# Altium project 04-ADC_antialiasing.PrjPcb
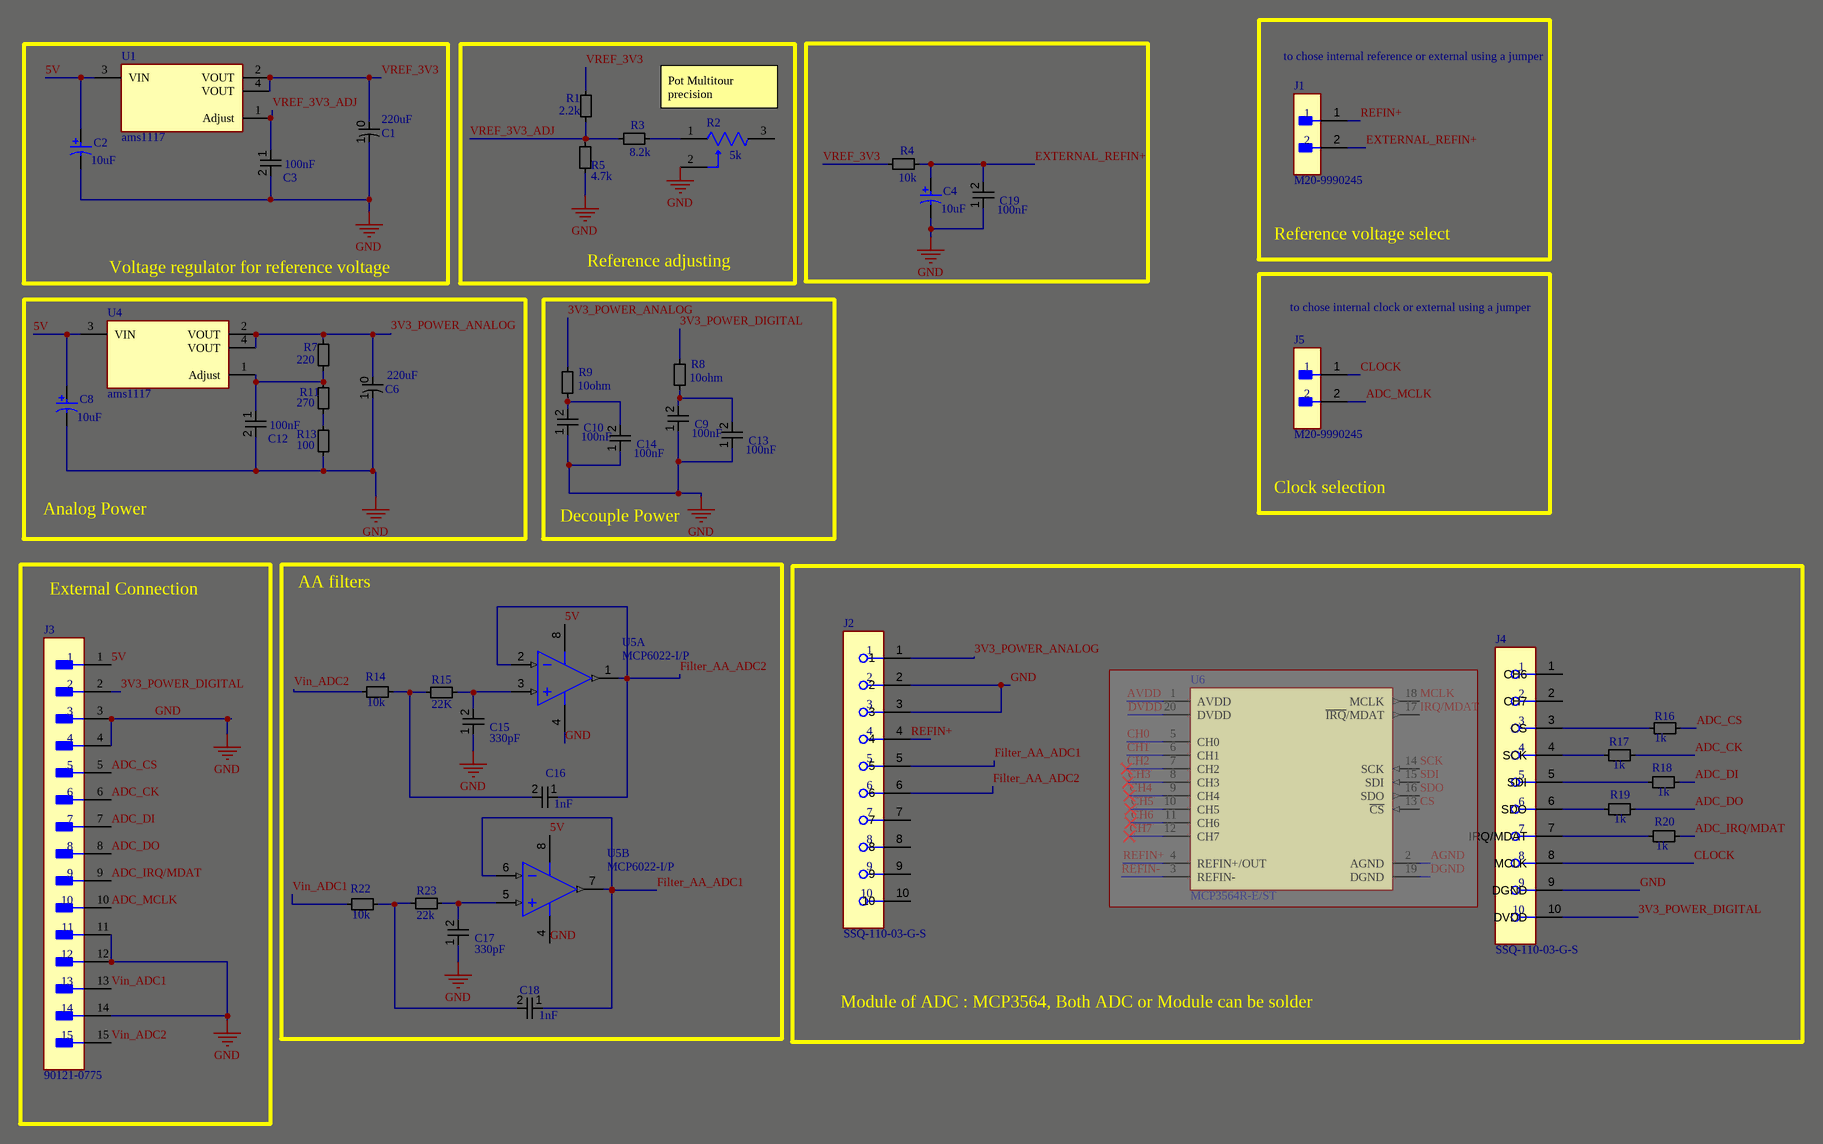
[diagram p0: 04-ADC_antialiasing.SchDoc]
CAGE_CODE: ?????; CONTRACT_NUMBER: <CONTRACT NO>; DOC_NO_ASSY_DWG: <ASSY DWG NO>; DOC_NO_BOM: <BOM DOC NO>; DOC_NO_FAB_DWG: <FAB DWG NO>; DOC_NO_SCH_DWG: <SCH DWG NO>; PCB_2_DEC_TOL: +/-.01; PCB_3_DEC_TOL: +/-.010; PCB_ANG_TOL: +/-1/2; PCB_ASSEMBLY_NO: <PCB ASSY NO>; PCB_CHECKER: - -----; PCB_CHECKER_APP_DATE: --/--/----; PCB_DESIGNER: - -----; PCB_DESIGNER_APP_DATE: --/--/----; PCB_DWG_NO: <PCB DWG NO>; PCB_ENGINEER: - -----; PCB_ENGINEER_APP_DATE: --/--/----; PCB_PART_NUMBER: <PCB PN>; PCB_REV: A; SCH_REV: A
1 sheet, 44 parts. Net scope: global (net labels, ports and power ports of the same name join across sheets).
Board file: 04-ADC_antialiasing.PcbDoc

## Sheet 04-ADC_antialiasing.SchDoc
size 431 x 279 mm; SheetNumber: 1; SheetTotal: 1; ENG_APP_DATE: --/--/--; DSN_APP_DATE: --/--/--; CHK_APP_DATE: --/--/--

### Parts
C1  value 220uF  [Cap_Pol_1cm_5mmPads_15mmmHigh]  (hidden comment: Cap_Pol)
C2  Capacitance: 10uF  [CAPPR55-200-1100X500X1200]  (hidden comment: ECA1HM100)
C3  value 100nF  [Cap_6.0%2A2.5%2A6mm]  (hidden comment: Cap_6.0*2.5*6mm)
C4  Capacitance: 10uF  [CAPPR55-200-1100X500X1200]  (hidden comment: ECA1HM100)
C6  value 220uF  [Cap_Pol_1cm_5mmPads_15mmmHigh]  (hidden comment: Cap_Pol)
C8  Capacitance: 10uF  [CAPPR55-200-1100X500X1200]  (hidden comment: ECA1HM100)
C9  value 100nF  [Cap_6.0%2A2.5%2A6mm]  (hidden comment: Cap_5.0*2.5*6mm)
C10  value 100nF  [Cap_6.0%2A2.5%2A6mm]  (hidden comment: Cap_5.0*2.5*6mm)
C12  value 100nF  [Cap_6.0%2A2.5%2A6mm]  (hidden comment: Cap_6.0*2.5*6mm)
C13  value 100nF  [Cap_6.0%2A2.5%2A6mm]  (hidden comment: Cap_5.0*2.5*6mm)
C14  value 100nF  [Cap_6.0%2A2.5%2A6mm]  (hidden comment: Cap_5.0*2.5*6mm)
C15  value 330pF  [Cap_6.0%2A2.5%2A6mm]  (hidden comment: Cap_6.0*2.5*6mm)
C16  value 1nF  [Cap_6.0%2A2.5%2A6mm]  (hidden comment: Cap_6.0*2.5*6mm)
C17  value 330pF  [Cap_6.0%2A2.5%2A6mm]  (hidden comment: Cap_6.0*2.5*6mm)
C18  value 1nF  [Cap_6.0%2A2.5%2A6mm]  (hidden comment: Cap_6.0*2.5*6mm)
C19  value 100nF  [Cap_6.0%2A2.5%2A6mm]  (hidden comment: Cap_5.0*2.5*6mm)
J1  M20-9990245  [FP-M20-9990245-MFG]
J2  SSQ-110-03-G-S  [FP-SSQ-110-03-G-S-MFG]
J3  90121-0775  [FP-90121-0775-MFG]
J4  SSQ-110-03-G-S  [FP-SSQ-110-03-G-S-MFG]
J5  M20-9990245  [FP-M20-9990245-MFG]
R1  value 2.2k  [Res_Axial_3.5x6.5mm_TH]  (hidden comment: Res_3.5x6.5mm_TH)
R2  Resistance: 5k  [FP-3006P-1-104LF-MFG]  (hidden comment: 3006P-1-104LF)
R3  value 8.2k  [Res_Axial_3.5x6.5mm_TH]  (hidden comment: Res_3.5x6.5mm_TH)
R4  value 10k  [Res_Axial_3.5x6.5mm_TH]  (hidden comment: Res_3.5x6.5mm_TH)
R5  value 4.7k  [Res_Axial_3.5x6.5mm_TH]  (hidden comment: Res_3.5x6.5mm_TH)
R7  value 220  [Res_Axial_3.5x6.5mm_TH]  (hidden comment: Res_3.5x6.5mm_TH)
R8  value 10ohm  [Res_Axial_3.5x6.5mm_TH]  (hidden comment: Res_3.5x6.5mm_TH)
R9  value 10ohm  [Res_Axial_3.5x6.5mm_TH]  (hidden comment: Res_3.5x6.5mm_TH)
R11  value 270  [Res_Axial_3.5x6.5mm_TH]  (hidden comment: Res_3.5x6.5mm_TH)
R13  value 100  [Res_Axial_3.5x6.5mm_TH]  (hidden comment: Res_3.5x6.5mm_TH)
R14  value 10k  [Res_Axial_3.5x6.5mm_TH]  (hidden comment: Res_3.5x6.5mm_TH)
R15  value 22K  [Res_Axial_3.5x6.5mm_TH]  (hidden comment: Res_3.5x6.5mm_TH)
R16  value 1k  [Res_Axial_3.5x6.5mm_TH]  (hidden comment: Res_3.5x6.5mm_TH)
R17  value 1k  [Res_Axial_3.5x6.5mm_TH]  (hidden comment: Res_3.5x6.5mm_TH)
R18  value 1k  [Res_Axial_3.5x6.5mm_TH]  (hidden comment: Res_3.5x6.5mm_TH)
R19  value 1k  [Res_Axial_3.5x6.5mm_TH]  (hidden comment: Res_3.5x6.5mm_TH)
R20  value 1k  [Res_Axial_3.5x6.5mm_TH]  (hidden comment: Res_3.5x6.5mm_TH)
R22  value 10k  [Res_Axial_3.5x6.5mm_TH]  (hidden comment: Res_3.5x6.5mm_TH)
R23  value 22k  [Res_Axial_3.5x6.5mm_TH]  (hidden comment: Res_3.5x6.5mm_TH)
U1  ams1117  [FP-ams1117-IPC_C]
U4  ams1117  [FP-ams1117-IPC_C]
U5  MCP6022-I/P  [PDIP300-P8]  (parts A,B of 2)
U6  MCP3564R-E/ST  [FP-C04-088-MFG]  (masked out: inside a compile mask, not in the netlist)

### Blocks framed on the sheet
Voltage regulator for reference voltage: C1-C3 U1
Reference adjusting: R1-R3 R5
Reference voltage select: J1
Analog Power: C6 C8 C12 R7 R11 R13 U4
Decouple Power: C9 C10 C13 C14 R8 R9
Clock selection: J5
External Connection: J3
AA filters: C15-C18 R14 R15 R22 R23 U5
Module of ADC : MCP3564, Both ADC or Module can be solder: J2 J4 R16-R20 U6

### Nets
GND: C1.1 C2.2 C3.2 C4.2 C6.1 C8.2 C9.1 C10.1 C12.2 C13.1 C14.1 C15.1 C17.1 C19.1 J2.2 J2.3 J3.3 J3.4 J3.11 J3.12 J3.14 J4.9(DGND) R2.2(WIPER) R5.1 R13.1 U5.4(VSS)
3V3_POWER_ANALOG: C6.0 J2.1 R7.0 R9.1 U4.2(VOUT) U4.4(VOUT)
3V3_POWER_DIGITAL: J3.2 J4.10(DVDD) R8.1
5V: C2.1 C8.1 J3.1 U1.3(VIN) U4.3(VIN) U5.8(VDD)
ADC_CK: J3.6 R17.0
ADC_CS: J3.5 R16.0
ADC_DI: J3.7 R18.0
ADC_DO: J3.8 R19.0
ADC_IRQ/MDAT: J3.9 R20.0
ADC_MCLK: J3.10 J5.2
CLOCK: J4.8(MCLK) J5.1
EXTERNAL_REFIN+: C4.1 C19.2 J1.2 R4.0
Filter_AA_ADC1: C18.1 J2.5 U5.6(VINB-) U5.7(VOUTB)
Filter_AA_ADC2: C16.1 J2.6 U5.1(VOUTA) U5.2(VINA-)
REFIN+: J1.1 J2.4
Vin_ADC1: J3.13 R22.0
Vin_ADC2: J3.15 R14.0
VREF_3V3: C1.0 R1.0 R4.1 U1.2(VOUT) U1.4(VOUT)
VREF_3V3_ADJ: C3.1 R1.1 R3.1 R5.0 U1.1(Adjust)
NetC9_2: C9.2 C13.2 R8.0
NetC10_2: C10.2 C14.2 R9.0
NetC12_1: C12.1 R7.1 R11.0 U4.1(Adjust)
NetC15_2: C15.2 R15.1 U5.3(VINA+)
NetC16_2: C16.2 R14.1 R15.0
NetC17_2: C17.2 R23.1 U5.5(VINB+)
NetC18_2: C18.2 R22.1 R23.0
NetJ4_3: J4.3(CS) R16.1
NetJ4_4: J4.4(SCK) R17.1
NetJ4_5: J4.5(SDI) R18.1
NetJ4_6: J4.6(SDO) R19.1
NetJ4_7: J4.7(IRQ/MDAT) R20.1
NetR2_1: R2.1(CCW) R3.0
NetR11_1: R11.1 R13.0

Not connected (* = marked no-connect by the designer): J2 7 8 9 10; J4 1(CH6) 2(CH7); R2 3(CW)

### Notes on the sheet
- Pot Multitour precision
- to chose internal reference or external using a jumper
- to chose internal clock or external using a jumper
- DWG. NO.
- REV.
- SHT.
- THIS DOCUMENT AND THE DATA DISCLOSED HEREIN OR HEREWITH IS THE PROPERTY OF ALTIUM LIMITED AND MAY BE FREELY DISTRIBUTED IN WHOLE. NO RIGHTS ARE RESERVED OR EXPRESS OR IMPLIED WARANTEE GIVEN.
- REVISION
- DESCRIPTION
- DATE
- APPROVED
- ENG:
- APPROVALS
- PROJECT
- DSN:
- CHK:
- REFERENCE DOCUMENTS
- PROJECT REVISION:
- TITLE
- DOCUMENT REVISION:
- DESIGN ITEM:
- BOM:
- FAB DWG:
- PCB DWG:
- ASSY DWG:
- SCALE:
- SIZE
- B
- CAGE CODE
- FILE NAME
- DWG NO.
- SHEET
- OF
- REV

### Library data of the parts
C2 C4 C8 = CMP-1665-00038-2: Aluminum Electrolytic Capacitor, 10 uF, +/- 20%, 50 V, -40 to 85 degC, 2-Pin THD, RoHS, Bulk; Manufacturer: Panasonic; Life (Hours): 2000Hour; Lead/Base Style: Straight; Dissipation Factor: 0.12%; Leakage Current: 3uA; Dielectric Material: Aluminium; Lead Diameter: 0.5mm; Voltage Rating: 50V; Ripple Current: 65mA; Package Reference: CAPPR55-200-1100X500X1200; Height: 11mm; Diameter: 5mm; REACH SVHC: NoSVHC; Mount: ThroughHole; Packaging: Bulk; Manufacturer URL: http://www.panasonic.com/; Termination: Radial; Datasheet URL: https://industrial.panasonic.com/cdbs/www-data/pdf/RDF0000/ABA0000C1218.pdf; Lead Free: LeadFree; Height - Seated (Max): 0.472inch; Case/Package: Radial; Package Description: 2-Pin Radial Lead, Dia 5 mm, Height 12 mm; Tolerance: 20%; Datasheet Version: Rev. 05, 10/2016; Package Quantity: 200; Ripple Current (AC): 65mA; Min Operating Temperature: -40degC; RoHSCompliant: true; Number of Pins: 2; Max Operating Temperature: 85degC; Voltage: 50V; Lead Pitch: 2mm; Radiation Hardening: No; Voltage Rating (DC): 50V; Length: 11mm
C9 C10 C13 C14 C19 = Cap_6.0*2.5*6mm
J1 J5 = CMP-15831-000105-1: CONN HEADER VERT 2POS 2.54MM; Working Voltage: 750V; Gender: Male; Number of Poles: 2; Current Rating: 3A; Mated Stacking Heights: 16.54mm; Contact Resistance: 25mR; Connector Type: Male Pin; Insulation Resistance: 10GR; Mating Cycles: 300; Voltage: 50V; Flammability Rating: UL94 V-0; Pitch: 2.54mm; Series: M20; Number of Contacts: 2; Height: 0.12inch; Min Operating Temperature: -40°C; Contact Finish - Mating: GOLD; Number of Positions: 2; Number of Rows: 1; Packaging: Bulk; Package Quantity: 1000; Voltage Rating (AC): 750V; Current: 3A; Mount: Through Hole; Case/Package: SIL; Orientation: Straight; Contact Shape: Square; Weight: 0.25lb; Radiation Hardening: No; Fastening Type: Pull; Length: 5.08mm; Depth: 2.54mm; Contact Mating Length: 0.24inch; Housing Material: Nylon; Reach SVHC Compliant: Yes; Insulation Material: Nylon; Color: Black; Width: 0.25inch; Insulation Color: Black; Contact Material: Brass; Contact Type: Male Pin; Termination: Solder; Max Operating Temperature: 105°C; Contact Plating: Gold; Housing Color: Black; Max Current Rating: 3A; Lead Pitch: 2.54mm
J2 J4 = CMP-02766-001399-1: CONN RCPT 10POS 0.1 GOLD PCB; Number of Contacts: 10; Gender: Receptacle; Pitch: 0.1inch; System: Connector; Length: 25.9mm; Mount: Through Hole; Housing Color: Black; Termination: Solder; RoHS Compliant: Yes; Width: 2.41mm; Number of Rows: 1; Packaging: Bulk; Number of Positions: 10; Housing Material: Plastic; Contact Plating: Gold; Contact Material: Bronze; REACH SVHC: No SVHC; Connector Type: Receptacle; Lead Free: Lead Free; Color: Black; Radiation Hardening: No; Contact Type: Female Socket; Height: 8.51mm; Series: SSQ
J3 = CMP-04776-000577-1: CGRID SR RA PN 675290MM AUE 15CK; Contact Resistance: 20mR; Working Voltage: 350V; Pitch: 2.54mm; Number of Contacts: 15; Glow Wire Compliant: Non-compliant; Current Rating: 3A; Number of Circuits: 14; Insulation Resistance: 5GR; Gender: Male; System: Connector; Radiation Hardening: No; Package Quantity: 900; Mount: Through Hole; Termination: Through Hole; Packaging: Tray; Contact Material: Brass; Number of Rows: 1; Housing Material: Polyester; Number of Positions: 15; Number of Poles: 15; Series: C-Grid III; Contact Plating: Gold; Min Operating Temperature: -55°C; Max Operating Temperature: 125°C; Voltage Rating (AC): 350V; Voltage Rating: 350V; Lead Pitch: 2.54mm; Orientation: Right Angle; Material: Glass
R2 = CMP-07234-000037-1: TRIMMER 100K OHM 0.75W PC PIN; Manufacturer Series: 3006; Resistance Law: Linear; Tolerance: 10%; Insulation Resistance: 1GR; Number of Terminals/Pins: 3; Pitch: 2.5mm; Temperature Coefficient: 100ppm/°C; Power Rating: 750mW; Actuator Orientation: Horizontal; Number of Turns: 15; Actuator Type: SCREW; Pin Diameter: 0.6mm; Terminal Finish: Tin; Number of Pins: 3; Packaging: Rail/Tube; Package Quantity: 100; RoHS Compliant: Yes; Technology: CERMET; Termination: Pin; Depth: 4.83mm; REACH SVHC: No SVHC; Military Standard: Not; Taper: Linear; Min Operating Temperature: -55°C; Series: 3006; Length: 20.57mm; Lead Free: Contains Lead; Max Power Dissipation: 750mW; Height: 6.35mm; Mount: Through Hole; Type: Potentiometer; Max Operating Temperature: 125°C; Weight: 0.04oz; Color: Blue; Resistor Type: Cermet; Width: 4.83mm; Radiation Hardening: No; Thickness: 5.59mm; Resistance Tolerance: 10%
U1 U4 = CMP-209535-000002-1: 1A LOW DROPOUT VOLTAGE REGULATOR; RoHS Compliant: Yes
U5 = CMP-0187-00094-3: None; Max Output Current: 30mA; Max Supply Voltage: 5.5V; Input Offset Voltage (Vos): 500uV; Bandwidth: 10MHz; Max Input Voltage: 5.8V; Number of Elements: 2; Supply Current: 1mA; Row Spacing: 9.4mm; Max Frequency: 10kHz; Common Mode Rejection Ratio: 70dB; Min Supply Voltage: 2.5V; Input Bias Current: 150pA; Min Input Voltage: -300mV; Slew Rate-Nom: 7V/µs; Max Supply Current: 2mA; Voltage Gain: 110dB; Settling Time: 250ns; Power Supply Rejection Ratio (PSRR): 74dB; Output Current: 22mA; Amplifier Type: GENERAL PURPOSE; Case/Package: PDIP; Number of Pins: 8; Lead Pitch: 2.54mm; Radiation Hardening: No; Min Operating Temperature: -40°C; Number of Amplifiers: 2; Number of Channels: 2; Nominal Supply Current: 1mA; Gain Bandwidth Product: 10MHz; Mount: Through Hole; Technology: CMOS; REACH SVHC: No SVHC; Length: 0.4inch; Number of Circuits: 2; Height: 0.195inch; Lead Free: Lead Free; Max Operating Temperature: 85°C; Packaging: Rail/Tube; Width: 0.28inch; Unity Gain Bandwidth Product: 10MHz; Input Offset Voltage-Max: 500uV; Package Quantity: 60; Slew Rate: 7V/µs; RoHS Compliant: Yes
U6 = CMP-00252-111742343-1: MCP3564R-E/ST 8-Channel Single ADC Delta-Sigma 153.6ksps 24-bit Serial 20-Pin TSSOP Tube; Interface: SPI; Max Junction Temperature (Tj): 150°C; Min Supply Voltage: 1.8V; Number of Channels: 8; Max Supply Voltage: 3.6V; Number of Converters: 1; Max Operating Temperature: 125°C; Lifecycle Status: Production; Height: 1.2mm; Ambient Temperature Range High: 125°C; NexarPartId: 111742343; Sampling Rate: 153.6ksps; Min Operating Temperature: -40°C